# EasyEDA schematic pico-pedal_2021-04-11.json
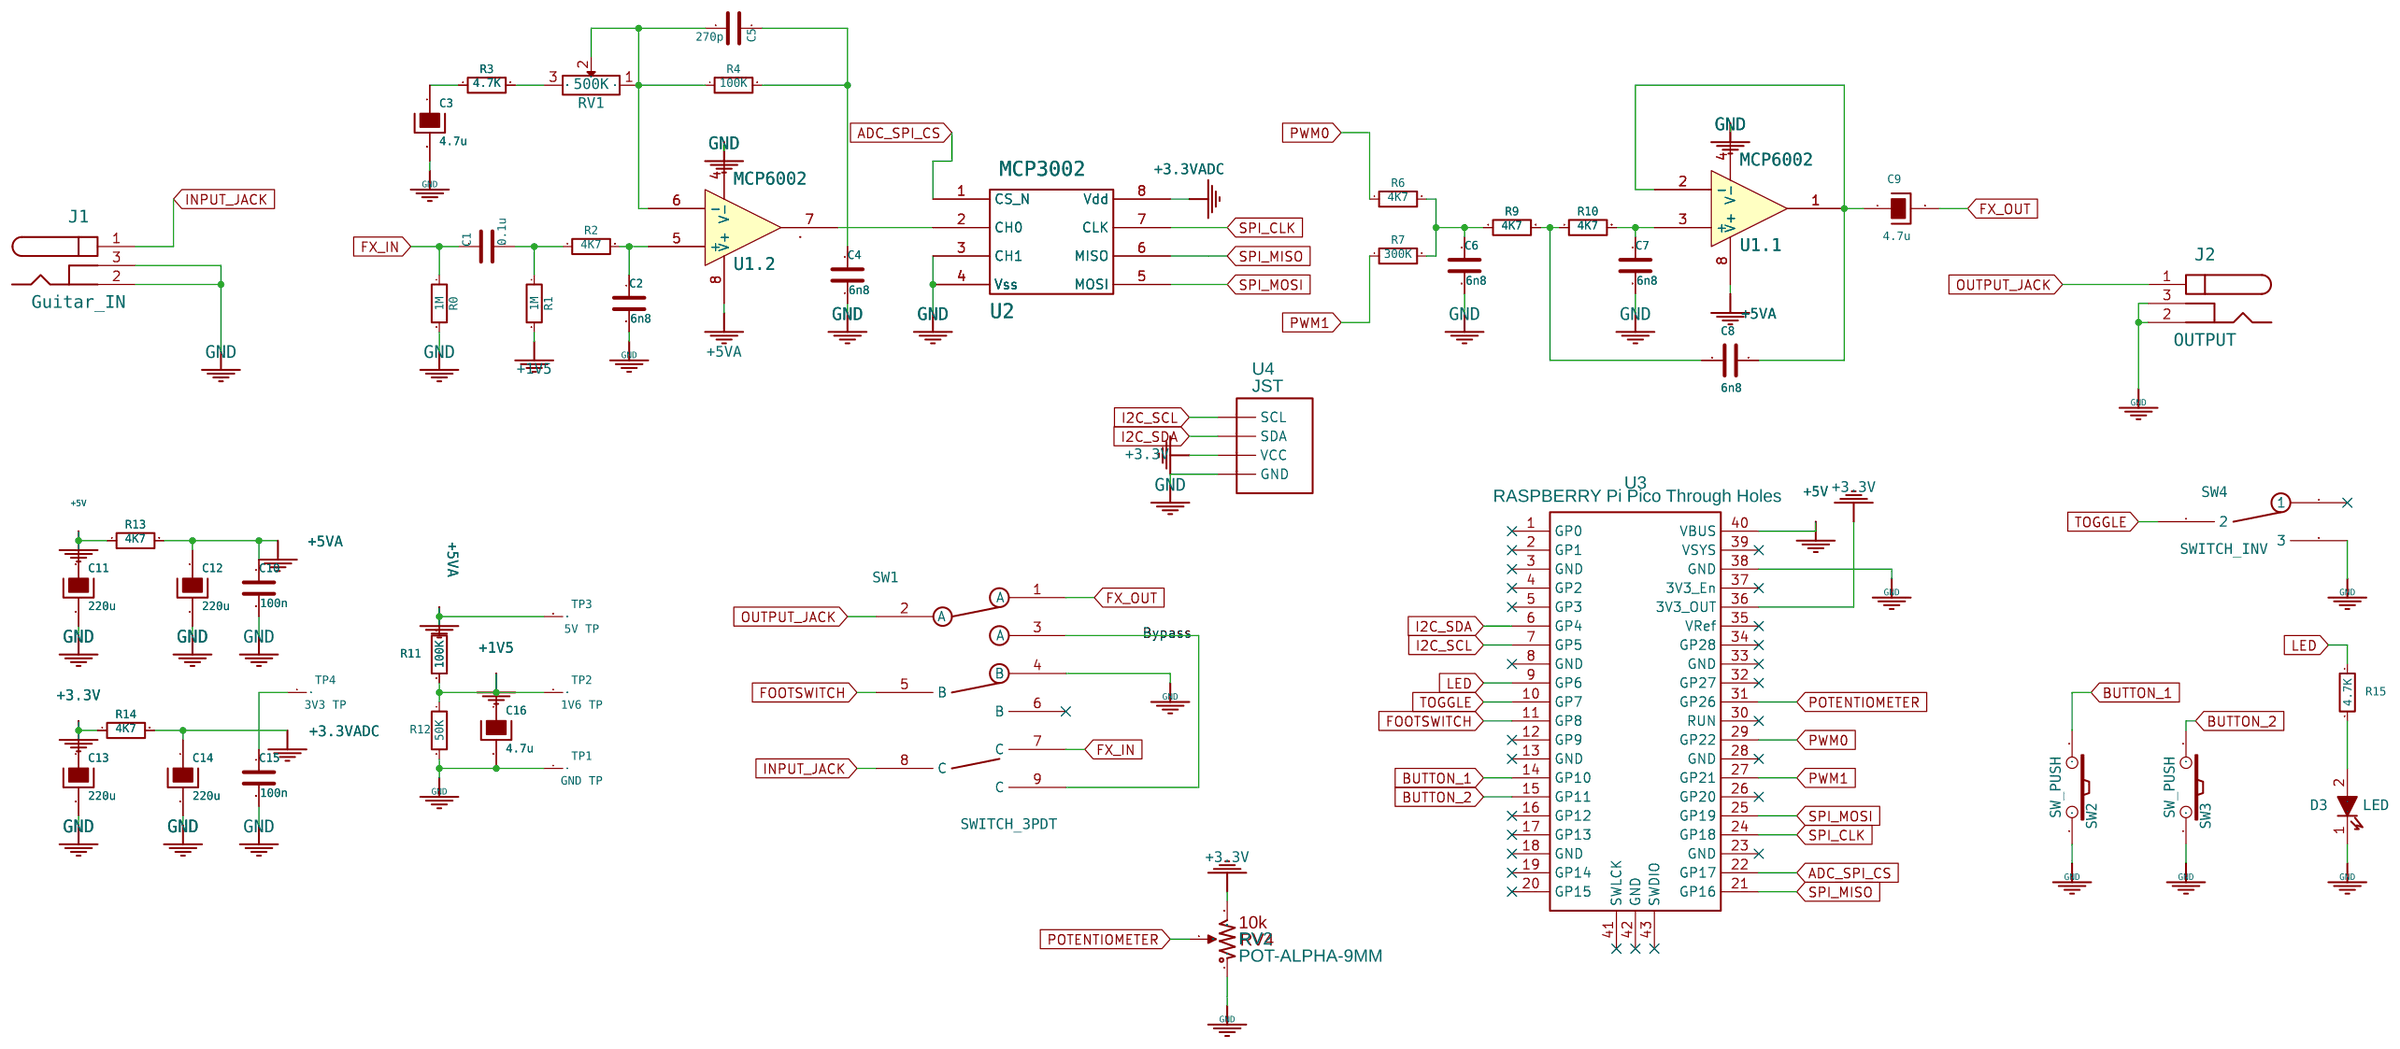
[diagram p0: schematic sheet]

## Parts
C1  0.1u  [C_RECT_L7.0MM_W2.0MM_P5.00MM]
C2  6n8  [C_RECT_L7.0MM_W2.0MM_P5.00MM]
C3  4.7u  [CP_RADIAL_D5.0MM_P2.50MM]
C4  6n8  [C_RECT_L7.0MM_W2.0MM_P5.00MM]
C5  270p  [C_RECT_L7.0MM_W2.0MM_P5.00MM]
C6  6n8  [C_RECT_L7.0MM_W2.0MM_P5.00MM]
C7  6n8  [C_RECT_L7.0MM_W2.0MM_P5.00MM]
C8  6n8  [C_RECT_L7.0MM_W2.0MM_P5.00MM]
C9  4.7u  [CP_RADIAL_D5.0MM_P2.50MM]
C10  100n  [C_RECT_L7.0MM_W2.0MM_P5.00MM]
C11  220u  [CP_RADIAL_D8.0MM_P3.50MM]
C12  220u  [CP_RADIAL_D8.0MM_P3.50MM]
C13  220u  [CP_RADIAL_D8.0MM_P3.50MM]
C14  220u  [CP_RADIAL_D8.0MM_P3.50MM]
C15  100n  [C_RECT_L7.0MM_W2.0MM_P5.00MM]
C16  4.7u  [CP_RADIAL_TANTAL_D5.0MM_P2.50MM]
D3  LED  [LED_D3.0MM]
J1  Guitar_IN  [STEREOJACK-NYS216_2]
J2  OUTPUT  [STEREOJACK-NYS216_2]
R0  1M  [R_AXIAL_DIN0207_L6.3MM_D2.5MM_P7.62MM_HORIZONTAL]
R1  1M  [R_AXIAL_DIN0207_L6.3MM_D2.5MM_P7.62MM_HORIZONTAL]
R2  4K7  [R_AXIAL_DIN0207_L6.3MM_D2.5MM_P7.62MM_HORIZONTAL]
R3  4.7K  [R_AXIAL_DIN0207_L6.3MM_D2.5MM_P7.62MM_HORIZONTAL]
R4  100K  [R_AXIAL_DIN0207_L6.3MM_D2.5MM_P7.62MM_HORIZONTAL]
R6  4K7  [R_AXIAL_DIN0207_L6.3MM_D2.5MM_P7.62MM_HORIZONTAL]
R7  300K  [R_AXIAL_DIN0207_L6.3MM_D2.5MM_P7.62MM_HORIZONTAL]
R9  4K7  [R_AXIAL_DIN0207_L6.3MM_D2.5MM_P7.62MM_HORIZONTAL]
R10  4K7  [R_AXIAL_DIN0207_L6.3MM_D2.5MM_P7.62MM_HORIZONTAL]
R11  100K  [R_AXIAL_DIN0207_L6.3MM_D2.5MM_P7.62MM_HORIZONTAL]
R12  50K  [R_AXIAL_DIN0207_L6.3MM_D2.5MM_P7.62MM_HORIZONTAL]
R13  4K7  [R_AXIAL_DIN0207_L6.3MM_D2.5MM_P7.62MM_HORIZONTAL]
R14  4K7  [R_AXIAL_DIN0207_L6.3MM_D2.5MM_P7.62MM_HORIZONTAL]
R15  4.7K  [R_AXIAL_DIN0207_L6.3MM_D2.5MM_P7.62MM_HORIZONTAL]
RV1  500K  [POTENTIOMETER_TRIMMER_PIHER_PT-15H5_VERTICAL_PX5.0MM_PY10.0MM]
RV2  POT-ALPHA-9MM  [POT-VERT-9MM]
SW1  SWITCH_3PDT  [3PDTSWITCH]
SW2  SW_PUSH  [SW-TH_MOMENTARY_PUSH_BUTTON]
SW3  SW_PUSH  [SW-TH_MOMENTARY_PUSH_BUTTON]
SW4  SWITCH_INV  [SWITCH_100SP5]
TP1  GND TP  [SOLDERWIREPAD_SINGLE_1MMDRILL]
TP2  1V6 TP  [SOLDERWIREPAD_SINGLE_1MMDRILL]
TP3  5V TP  [SOLDERWIREPAD_SINGLE_1MMDRILL]
TP4  3V3 TP  [SOLDERWIREPAD_SINGLE_1MMDRILL]
U1  MCP6002  [DIP-8_W7.62MM_SOCKET_LONGPADS]  (sections 1,2)
U2  MCP3002  [DIP-8_W7.62MM_SOCKET_LONGPADS]
U3  RASPBERRY Pi Pico Through Holes  [RASPBERRY PI PICO]
U4  JST  [JST]

## Library data of the parts
RV2 = POT-ALPHA-9MM: Contributor: Alberto De Sousa; Manufacturer Part: None; link: None
U3 = RASPBERRY Pi Pico Through Holes: Contributor: untung91
U4 = JST: Contributor: nick_asbury

## Nets
+1V5: C16.1 R1.2 R11.2 R12.1 TP2.1
+3.3V: C13.1 R14.1 RV2.3 U3.36(3V3_OUT) U4.VCC
+3.3VADC: C14.1 R14.2 U2.8(Vdd)
+5V: C11.1 R13.1 U3.40(VBUS)
+5VA: C10.1 C12.1 R11.1 R13.2 TP3.1 U1.8(V+)
GND: C2.2 C3.2 C4.2 C6.2 C7.2 C10.2 C11.2 C12.2 C13.2 C14.2 C15.2 C16.2 D3.1(K) J1.2 J1.3 J2.2 J2.3 R0.2 R12.2 RV2.1 SW1.4(B) SW2.2 SW3.2 SW4.3 TP1.1 U1.4(V-) U2.3(CH1) U2.4(Vss) U3.38(GND) U4.GND
ADC_SPI_CS: U2.1(CS_N) U3.22(GP17)
BUTTON_1: SW2.1 U3.14(GP10)
BUTTON_2: SW3.1 U3.15(GP11)
Bypass: SW1.3(A) SW1.9(C)
FOOTSWITCH: SW1.5(B) U3.11(GP8)
FX_IN: C1.1 R0.1 SW1.7(C)
FX_OUT: C9.2 SW1.1(A)
I2C_SCL: U3.7(GP5) U4.SCL
I2C_SDA: U3.6(GP4) U4.SDA
INPUT_JACK: J1.1 SW1.8(C)
LED: R15.1 U3.9(GP6)
OUTPUT_JACK: J2.1 SW1.2(A)
POTENTIOMETER: RV2.2 U3.31(GP26)
PWM0: R6.1 U3.29(GP22)
PWM1: R7.1 U3.27(GP21)
SPI_CLK: U2.7(CLK) U3.24(GP18)
SPI_MISO: U2.6(MISO) U3.21(GP16)
SPI_MOSI: U2.5(MOSI) U3.25(GP19)
TOGGLE: SW4.2 U3.10(GP7)
Net-(C1-2): C1.2 R1.1 R2.1
Net-(C2-1): C2.1 R2.2 U1.5(+)
Net-(C3-1): C3.1 R3.1
Net-(C4-1): C4.1 C5.1 R4.2
Net-(C5-2): C5.2 R4.1 RV1.1 RV1.2 U1.6(-)
Net-(C6-1): C6.1 R6.2 R7.2 R9.1
Net-(C7-1): C7.1 R10.2 U1.3(+)
Net-(C8-1): C8.1 C9.1 U1.1 U1.2(-)
Net-(C8-2): C8.2 R9.2 R10.1
Net-(C15-1): C15.1 TP4.1
Net-(D3-2): D3.2(A) R15.2
Net-(R3-2): R3.2 RV1.3
Net-(U1.2-7): U1.7 U2.2(CH0)

Not connected (* = marked no-connect by the designer): SW1 6(B)*; SW4 1*; U3 1(GP0)* 2(GP1)* 3(GND)* 4(GP2)* 5(GP3)* 8(GND)* 12(GP9)* 13(GND)* 16(GP12)* 17(GP13)* 18(GND)* 19(GP14)* 20(GP15)* 23(GND)* 26(GP20)* 28(GND)* 30(RUN)* 32(GP27)* 33(GND)* 34(GP28)* 35(VRef)* 37(3V3_En)* 39(VSYS)* 41(SWLCK)* 42(GND)* 43(SWDIO)*
